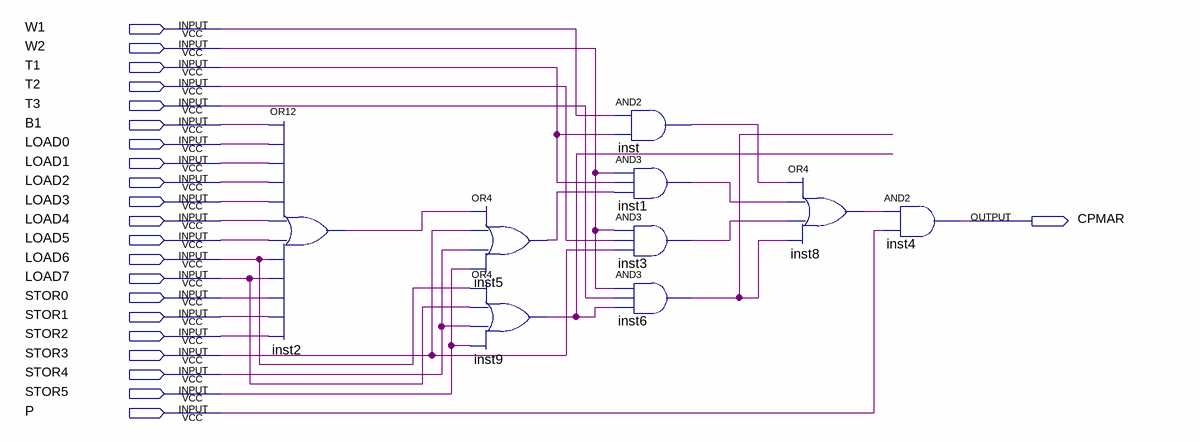
[diagram p0: schematic sheet]
// Quartus schematic CPMAR.bdf as structural Verilog: 9 symbols, 22 pins
module CPMAR (
  input  W1,
  input  W2,
  input  T1,
  input  T2,
  input  T3,
  input  B1,
  input  LOAD0,
  input  LOAD1,
  input  LOAD2,
  input  LOAD3,
  input  LOAD4,
  input  LOAD5,
  input  LOAD6,
  input  LOAD7,
  input  STOR0,
  input  STOR1,
  input  STOR2,
  input  STOR3,
  input  STOR4,
  input  STOR5,
  input  P,
  output CPMAR
);

  wire inst1_out, inst2_out, inst3_out, inst5_out, inst6_out, inst8_out, inst9_out, inst_out;

  or inst2 (inst2_out, B1, LOAD0, LOAD1, LOAD2, LOAD3, LOAD4, LOAD5, LOAD6, LOAD7, STOR0, STOR1, STOR2);
  or inst5 (inst5_out, inst2_out, STOR3, STOR4, STOR5);
  or inst9 (inst9_out, LOAD6, LOAD7, STOR4, STOR5);
  and inst (inst_out, W1, T1);
  and inst1 (inst1_out, W2, T1, inst5_out);
  and inst3 (inst3_out, W2, T2, STOR3);
  and inst6 (inst6_out, W2, T3, inst9_out);
  or inst8 (inst8_out, inst_out, inst1_out, inst3_out, inst6_out);
  and inst4 (CPMAR, inst8_out, P);
endmodule
